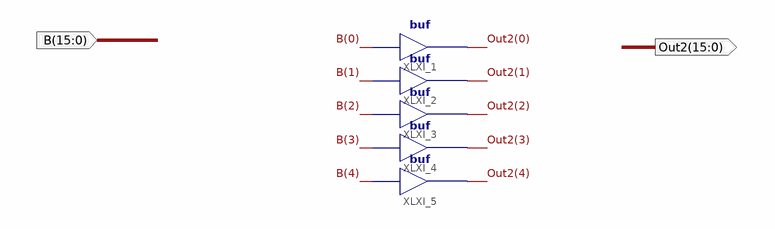
[diagram p0: schematic sheet 1]
// Xilinx ISE schematic ShiftControlModule.sch (spartan3e) as structural Verilog: 5 symbols, 2 ports
module ShiftControlModule (
  input  [15:0] B,
  output [15:0] Out2
);

  buf XLXI_1 (Out2[0], B[0]);
  buf XLXI_2 (Out2[1], B[1]);
  buf XLXI_3 (Out2[2], B[2]);
  buf XLXI_4 (Out2[3], B[3]);
  buf XLXI_5 (Out2[4], B[4]);
endmodule
